# Altium schematic sheet VCU-S04-V00-PSU5V-2A.SchDoc: Power Supply (20-40V to 3v3 @ 0.1-0.6A)
size A3; DrawnBy: Jonn Dillon; DocumentNumber: 3; SheetNumber: 14; SheetTotal: 14; Version: 00; Project: AMU 2020 (Sourced from BMS 2020); PageSetup: Record=PageOptions|CenterHorizontal=True|CenterVertical=True|PrintScale=0.97|XCorrection=1.00|YCorrection=1.00|PrintKind=0|BorderSize=5000000|LeftOffset=0|BottomOffset=0|Orientation=2|PaperLength=1000|PaperWidth=1000|Scale=100|PaperSource=7|PrintQuality=-4|MediaType=1|DitherType=10|PaperKind=A4|PrintScaleMode=1
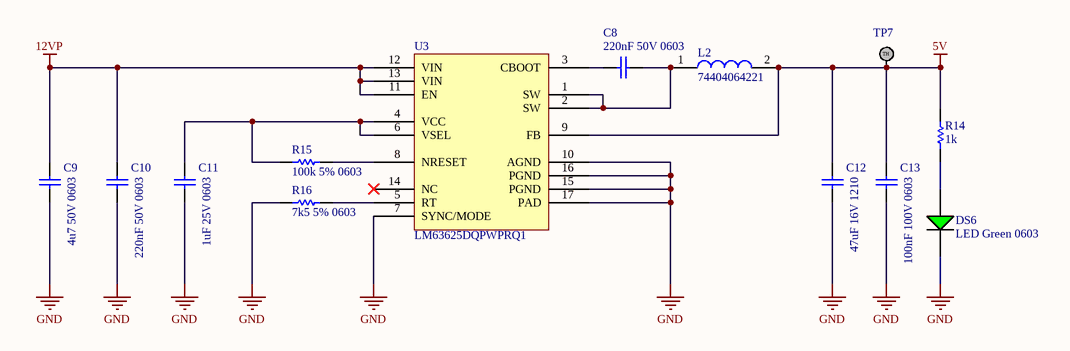
[diagram p0: VCU-S04-V00-PSU5V-2A.SchDoc]

## Parts
C8  220nF 50V 0603  [Cap_Ceramic_0603]
C9  4u7 50V 0603  [Cap_Ceramic_0603]
C10  220nF 50V 0603  [Cap_Ceramic_0603]
C11  1uF 25V 0603  [Cap_Ceramic_0603]
C12  47uF 16V 1210  [Cap_Ceramic_1210]
C13  100nF 100V 0603  [Cap_Ceramic_0603]
DS6  LED Green 0603  [LED GREEN 0603]
L2  74404064221  [Inductor_6x6mm]
R14  1k  [Res_ThinFilm_0603]
R15  100k 5% 0603  [Res_ThinFilm_0603]
R16  7k5 5% 0603  [Res_ThinFilm_0603]
TP7  TestPoint  [TestPoint]  (value not drawn)
U3  LM63625DQPWPRQ1

## Nets
5V: C12.2 C13.2 L2.2 R14.2 TP7.1 U3.9(FB)
12VP: C9.2 C10.2 U3.11(EN) U3.12(VIN) U3.13(VIN)
GND: C9.1 C10.1 C11.1 C12.1 C13.1 DS6.2(C) R16.1 U3.7(SYNC/MODE) U3.10(AGND) U3.15(PGND) U3.16(PGND) U3.17(PAD)
NetC8_1: C8.1 U3.3(CBOOT)
NetC8_2: C8.2 L2.1 U3.1(SW) U3.2(SW)
NetC11_2: C11.2 R15.1 U3.4(VCC) U3.6(VSEL)
NetDS6_1: DS6.1(A) R14.1
NetR15_2: R15.2 U3.8(NRESET)
NetR16_2: R16.2 U3.5(RT)

Not connected (* = marked no-connect by the designer): U3 14(NC)*

## Notes on the sheet
- Revision History:
- Sheet Title:
- Rev
- Date
- Description
- Project:
- Size:
- Drawn By:
- A3
- Number:
- Revision:
- Sheet
- Version:
- of
- QUT Motorsport
- O-120, Gardens Point
- 2 George Street
- Brisbane, QLD 4000
- Australia
- Print Date:
- Print Time:
- File Name:
- (in symbol TestPoint) TH

## Library data of the parts
C8 C10 = 220nF 50V 5% X7R 0603: Capacitor, Ceramic, SMD, 220nF, 50V, 5%, X7R, 0603
C9 = 4u7 50V 5% X7R 0603: Capacitor, Ceramic, SMD, 4u7, 50V, 5%, X7R, 0603
C11 = 1uF 25V 5% X7R 0603: Capacitor, Ceramic, SMD, 1uF, 25V, 5%, X7R, 0603
C12 = 47uF 16V 10% X7R 1210: Capacitor, Ceramic, SMD, 47uF, 16V, 5%, X7R, 1210
C13 = 100nF 100V 5% X7R 0603: Capacitor, Ceramic, SMD, 100nF, 100V, 5%, X7R, 0603
L2 = 74404064221: FIXED IND 220UH 660MA 850 MOHM; ComponentLink1Description: Digikey; ComponentLink1URL: https://www.digikey.com.au/product-detail/en/w%C3%BCrth-elektronik/74404064221/732-7261-1-ND/5353241; ComponentLink2Description: LCSC A; ComponentLink2URL: https://lcsc.com/product-detail/Power-Inductors_Sunlord-SWPA6045S221MT_C91047.html; ComponentLink3Description: LCSC B; ComponentLink3URL: https://lcsc.com/product-detail/Power-Inductors_SXN-Shun-Xiang-Nuo-Elec-SMNR6045-221MT_C467145.html
R14 = 1k 5% 0603: Resistor, SMD, 1k, 0.1W, 5%, 0603
R15 = 100k 5%, 0603: Resistor, SMD, 100k, 0.1W, 5%, 0603
R16 = 7k5 5% 0603: Resistor, SMD, 7k5, 0.1W, 5%, 0603
U3 = LM63625DQPWPRQ1: Buck Switching Regulator IC Positive Adjustable 1V 1 Output 2.5A 16-PowerTSSOP (0.173", 4.40mm Width); ComponentLink1Description: Digikey; ComponentLink1URL: https://www.digikey.ee/product-detail/en/texas-instruments/LM63625DQPWPRQ1/296-LM63625DQPWPRQ1CT-ND/10716102; ComponentLink2Description: Datasheet; ComponentLink2URL: https://www.ti.com/general/docs/suppproductinfo.tsp?distId=10&gotoUrl=http%3A%2F%2Fwww.ti.com%2Flit%2Fgpn%2Flm555